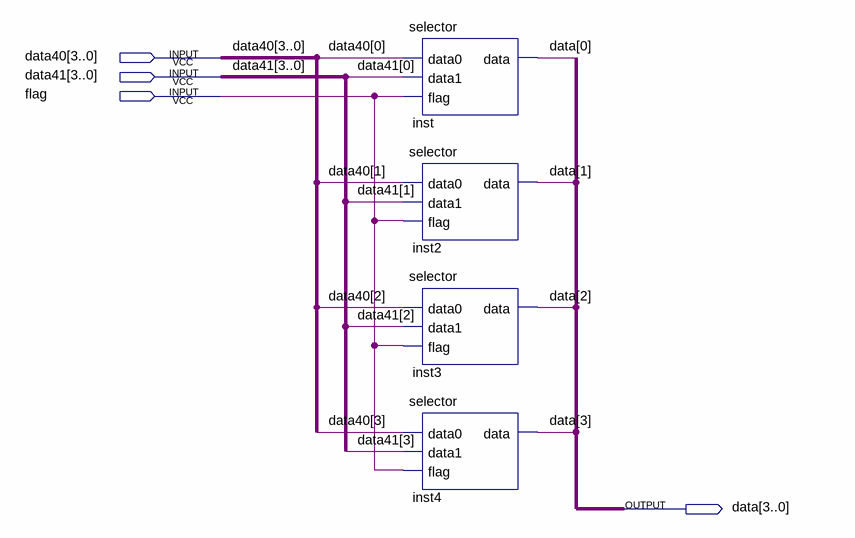
[diagram p0: schematic sheet]
// Quartus schematic selector4.bdf as structural Verilog: 4 symbols, 4 pins
module selector4 (
  input  [3:0] data40,
  input  [3:0] data41,
  input  flag,
  output [3:0] data
);

  selector inst (.data0(data40[0]), .data1(data41[0]), .flag(flag), .data(data[0]));
  selector inst2 (.data0(data40[1]), .data1(data41[1]), .flag(flag), .data(data[1]));
  selector inst3 (.data0(data40[2]), .data1(data41[2]), .flag(flag), .data(data[2]));
  selector inst4 (.data0(data40[3]), .data1(data41[3]), .flag(flag), .data(data[3]));
endmodule
